# EAGLE design geiger_fixedR5R6 (EAGLE 7.4.0)
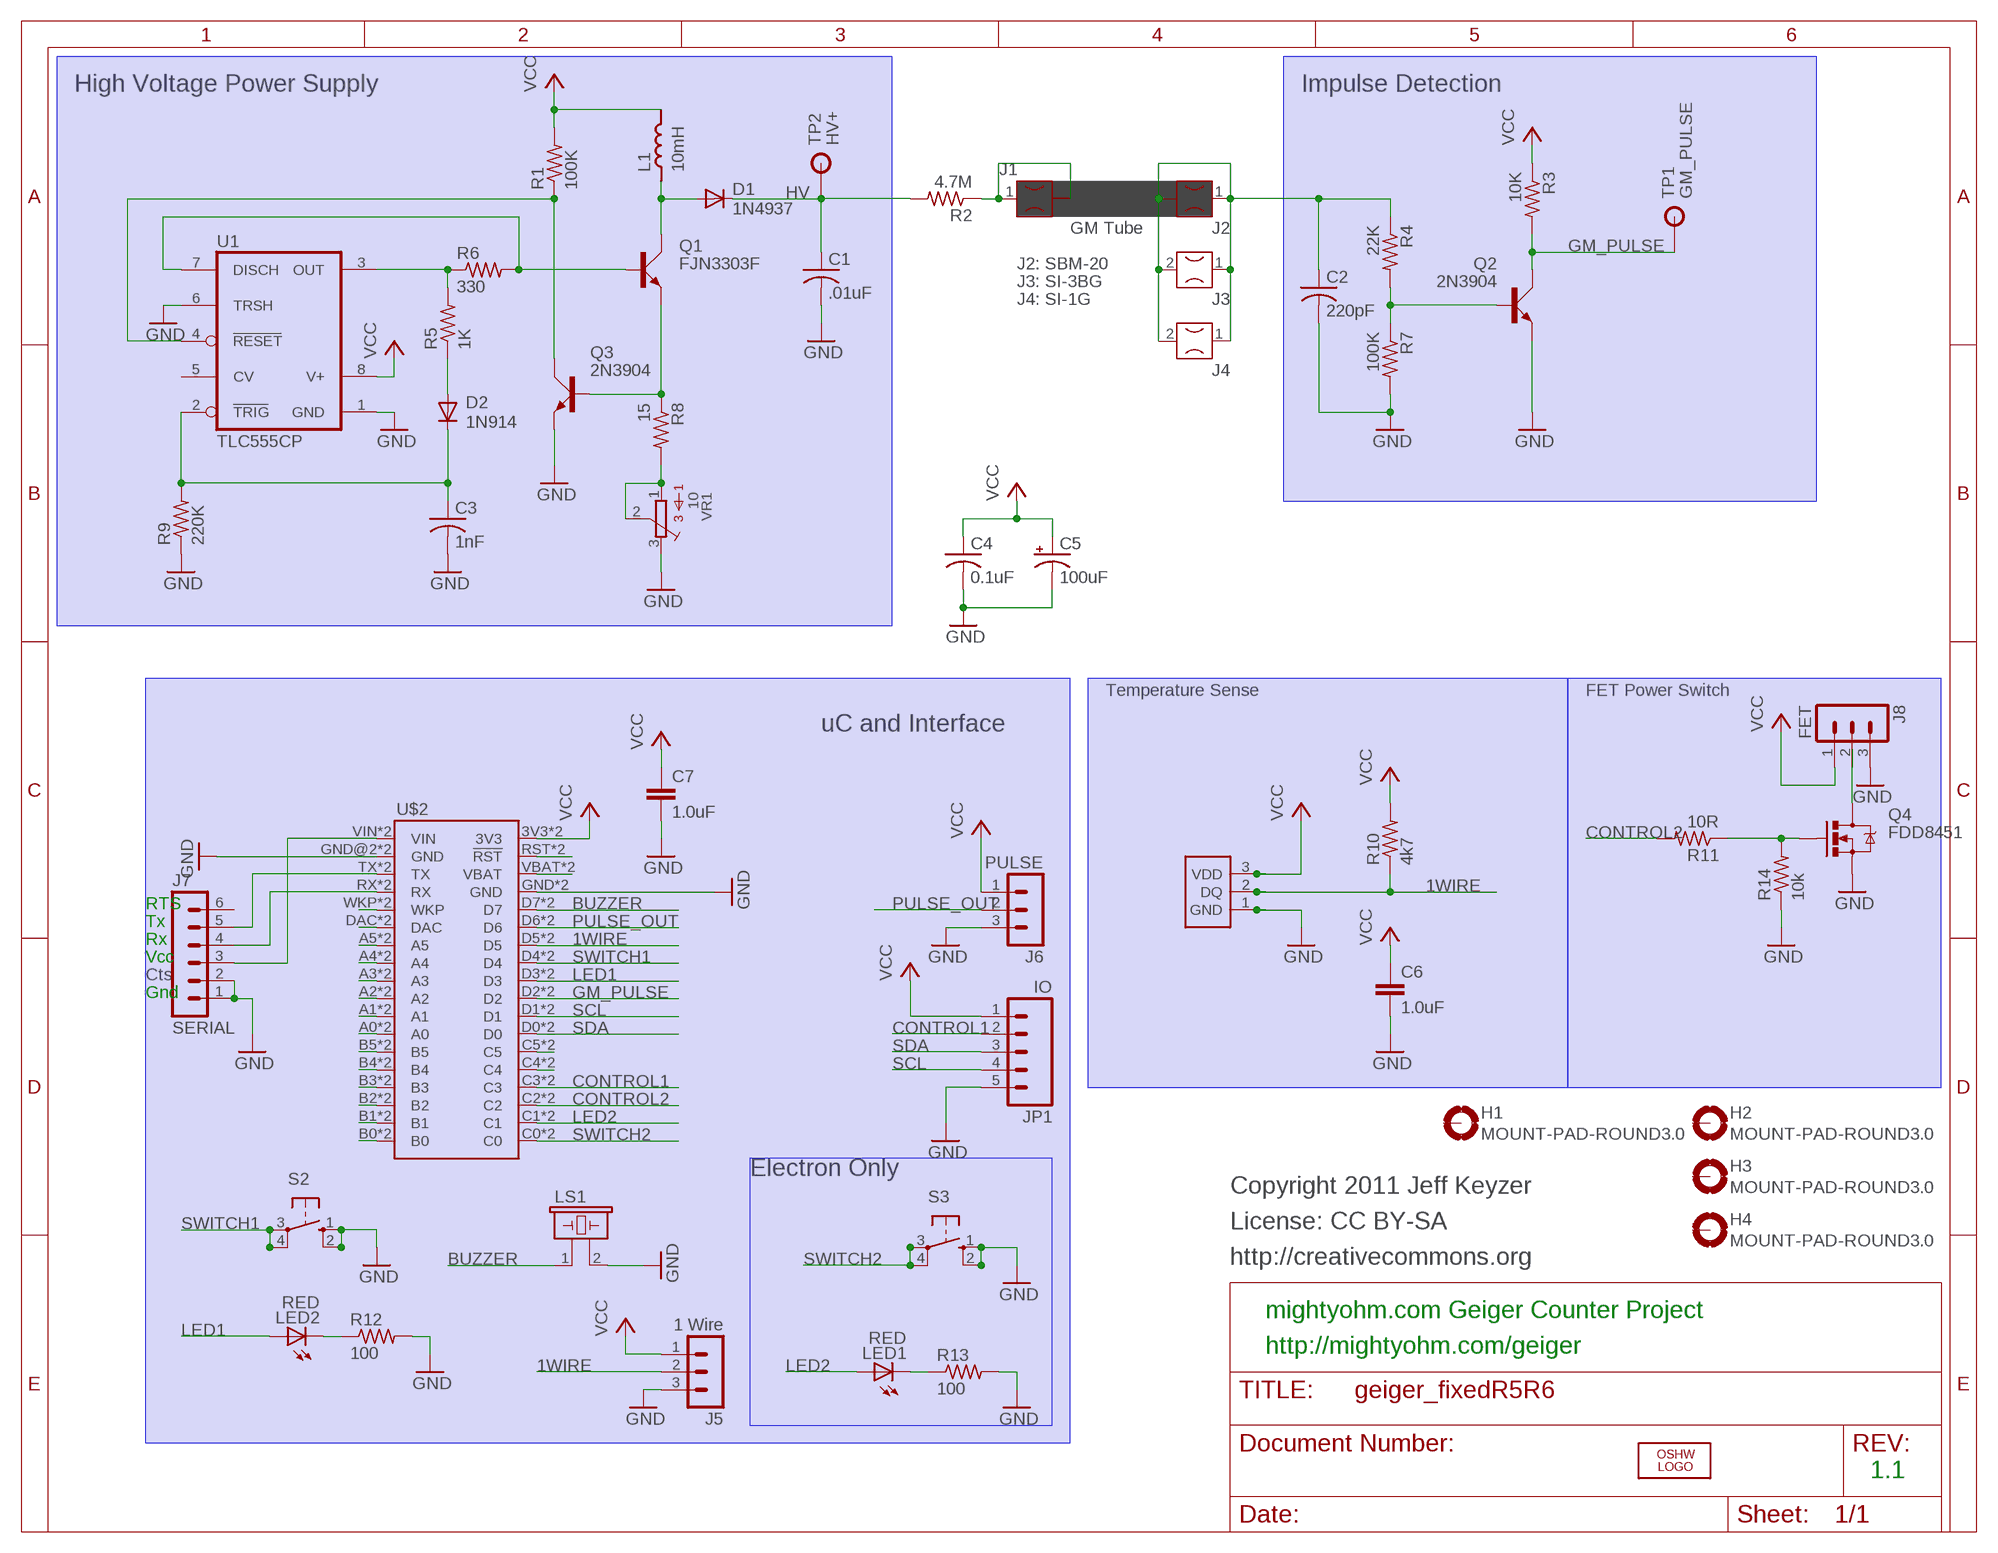
[diagram p0: schematic, sheet 1]

## Parts
C1  .01uF  C-US102-043X133  [C102-043X133]
C2  220pF  C-US050-030X075  [C050-030X075]
C3  1nF  C-US050-025X075  [C050-025X075]
C4  0.1uF  C-US025-025X050  [C025-025X050]
C5  100uF  CPOL-USE2.5-6  [E2,5-6]
C6  1.0uF  1.0UF-25V-+80/-20(0805)"  [0805-CAP]
C7  1.0uF  1.0UF-25V-+80/-20(0805)"  [0805-CAP]
D1  1N4937  1N4933  [DO41-10]
D2  1N914  1N4148DO35-7  [DO35-7]
H1  MOUNT-PAD-ROUND3.0  [3,0-PAD]
H2  MOUNT-PAD-ROUND3.0  [3,0-PAD]
H3  MOUNT-PAD-ROUND3.0  [3,0-PAD]
H4  MOUNT-PAD-ROUND3.0  [3,0-PAD]
J1  FUSECLIPPCMOUNT  [FUSECLIP_PCMOUNT]
J2  FUSECLIPPCMOUNT  [FUSECLIP_PCMOUNT]
J3  FUSECLIPPCMOUNT  [FUSECLIP_PCMOUNT]
J4  FUSECLIPPCMOUNT  [FUSECLIP_PCMOUNT]
J5  1 Wire  MA03-1  [MA03-1]
J6  PULSE  MA03-1  [MA03-1]
J7  SERIAL  MA06-1  [MA06-1]
J8  FET  MA03-1  [MA03-1]
JP1  IO  M05PTH  [1X05]
L1  10mH  INDELC09D  [ELC09D]
LED1  RED  LED5MM  [LED5MM]
LED2  RED  LED5MM  [LED5MM]
LOGO1  OSHW_LOGO_FILLX0200-NT  [OSHW_FILLX200_NOTEXT]
LS1  PIEZO17MM  [PS1740P02E]
Q1  FJN3303F  2N3704  [TO92C]
Q2  2N3904  [TO92D]
Q3  2N3904  [TO92D]
Q4  FDD8451  MOSFET-NCHANNELFDD8780  [DPAK]
R1  100K  R-US_0207/10  [0207/10]
R2  4.7M  R-US_0207/10  [0207/10]
R3  10K  R-US_0207/10  [0207/10]
R4  22K  R-US_0207/10  [0207/10]
R5  1K  R-US_0207/10  [0207/10]
R6  330  R-US_0207/10  [0207/10]
R7  100K  R-US_0207/10  [0207/10]
R8  15  R-US_0207/10  [0207/10]
R9  220K  R-US_0207/10  [0207/10]
R10  4k7  R-US_R0805  [R0805]
R11  10R  R-US_R0805  [R0805]
R12  100  R-US_R0805  [R0805]
R13  100  R-US_R0805  [R0805]
R14  10k  R-US_R0805  [R0805]
S1  DB18B20+  SENSOR-DS18B20  [TO-92-TRIANGLE]
S2  10-XX  [B3F-10XX]
S3  10-XX  [B3F-10XX]
TP1  GM_PULSE  TPPTH  [TP_PTH]
TP2  HV+  TPPTH  [TP_PTH]
U1  TLC555CP  ICM7555  [DIL08]
U$2  ELECTRONDUALNAMED  [ELECTRON_SIMPLE_SILK_NAMES_DUAL]
VR1  10  3386-P  [3386P]

## Nets
1WIRE: J5.2 R10.1 S1.2(DQ) U$2.D5 U$2.D5_1(D5)
BUZZER: LS1.1 U$2.D7 U$2.D7_1(D7)
CONTROL1: JP1.2 U$2.C3 U$2.C3_1(C3)
CONTROL2: R11.2 U$2.C2 U$2.C2_1(C2)
GM_PULSE: Q2.C R3.2 TP1.P$1(TP) U$2.D2 U$2.D2_1(D2)
GND: C1.2 C2.2 C3.2 C4.2 C5.- C6.2 C7.2 J5.3 J6.3 J7.1 J7.2 J8.3 JP1.5 LS1.2 Q2.E Q3.E Q4.3(S) R7.2 R9.1 R12.2 R13.2 R14.1 S1.1(GND) S2.1(S) S2.2(S1) S3.1(S) S3.2(S1) U1.1(GND) U1.6(TRSH) U$2.GND U$2.GND@2(GND) U$2.GND_1(GND) U$2.GND_1B(GND) VR1.3
HV: C1.1 D1.C R2.2 TP2.P$1(TP)
LED1: LED2.A U$2.D3 U$2.D3_1(D3)
LED2: LED1.A U$2.C1 U$2.C1_1(C1)
N$1: D2.A R5.1
N$2: U$2.RST(!RST) U$2.RST_1(!RST)
N$3: Q3.C R1.1 U1.4(RESET)
N$4: U$2.VBAT U$2.VBATT_1(VBAT)
N$5: U$2.C5 U$2.C5_1(C5)
N$6: J7.3 U$2.VIN U$2.VIN_1B(VIN)
N$7: J7.5 U$2.TX U$2.TX_1(TX)
N$8: Q1.B R6.2 U1.7(DISCH)
N$9: C3.1 D2.C R9.2 U1.2(TRIG)
N$10: R5.2 R6.1 U1.3(OUT)
N$11: Q1.E Q3.B R8.1
N$12: D1.A L1.1 Q1.C
N$13: J7.4 U$2.RX U$2.RX_1(RX)
N$14: Q2.B R4.2 R7.1
N$15: J1.1 J1.2 R2.1
N$16: U$2.WKP U$2.WKP_1(WKP)
N$17: U$2.DAC U$2.DAC_1(DAC)
N$18: LED2.K(C) R12.1
N$19: U$2.A5 U$2.A5_1(A5)
N$20: U$2.A4 U$2.A4_1(A4)
N$21: LED1.K(C) R13.1
N$22: U$2.A3 U$2.A3_1(A3)
N$23: R8.2 VR1.1 VR1.2
N$24: U$2.A2 U$2.A2_1(A2)
N$25: U$2.A1 U$2.A1_1(A1)
N$26: U$2.A0 U$2.A0_1(A0)
N$27: U$2.B5 U$2.B5_1(B5)
N$28: U$2.B4 U$2.B4_1(B4)
N$29: U$2.B3 U$2.B3_1(B3)
N$30: U$2.B2 U$2.B2_1(B2)
N$31: U$2.B1 U$2.B1_1(B1)
N$32: U$2.B0 U$2.B0_1(B0)
N$33: U$2.C4 U$2.C4_1(C4)
N$34: Q4.1(G) R11.1 R14.2
N$35: J8.2 Q4.4(D)
N$39: C2.1 J2.1 J2.2 J3.1 J3.2 J4.1 J4.2 R4.1
PULSE_OUT: J6.2 U$2.D6 U$2.D6_1(D6)
SCL: JP1.4 U$2.D1 U$2.D1_1(D1)
SDA: JP1.3 U$2.D0 U$2.D0_1(D0)
SWITCH1: S2.3(P) S2.4(P1) U$2.D4 U$2.D4_1(D4)
SWITCH2: S3.3(P) S3.4(P1) U$2.C0 U$2.C0_1(C0)
VCC: C4.1 C5.+ C6.1 C7.1 J5.1 J6.1 J8.1 JP1.1 L1.2 R1.2 R3.1 R10.2 S1.3(VDD) U1.8(V+) U$2.3V3 U$2.3V3_1(3V3)
Unconnected: H1.B3,0(MOUNT) H2.B3,0(MOUNT) H3.B3,0(MOUNT) H4.B3,0(MOUNT) J7.6 U1.5(CV)

## Notes on the sheet
- High Voltage Power Supply | Impulse Detection
- GM Tube
- J2: SBM-20
- J3: SI-3BG
- J4: SI-1G
- Temperature Sense | FET Power Switch
- uC and Interface
- RTS
- Tx
- Rx
- Vcc
- Cts
- Gnd
- Electron Only
- Copyright 2011 Jeff Keyzer
- License: CC BY-SA
- http://creativecommons.org
- mightyohm.com Geiger Counter Project
- http://mightyohm.com/geiger
- 1.1

## Library data of the parts
C1-C4 = resistor:C-US: CAPACITOR, American symbol
C5 = resistor:CPOL-US: POLARIZED CAPACITOR, American symbol
C6 C7 = SparkFun-Capacitors:1.0UF-25V-+80/-20(0805): CAP-11625; PROD_ID: CAP-11625
D1 = diode:1N4933: DIODE fast recovery rectifier, 1A
D2 = diode:1N4148: DIODE high speed (Philips)
H1-H4 = holes:MOUNT-PAD-ROUND: MOUNTING PAD, round
J1-J4 = connectors:FUSECLIP
J5 J6 J8 = mightyohm:MA03-1: PIN HEADER; OC_FARNELL: unknown; OC_NEWARK: unknown
J7 = connectors:MA06-1: PIN HEADER
JP1 = SparkFun-Connectors:M05: Header 5 Standard 5-pin 0.1" header. Use with straight break away headers (SKU : PRT-00116), right angle break away headers (PRT-00553), swiss pins (PRT-00743), machine pins (PRT-00117), and female headers (PRT-00115). Molex polarized connector foot print use with SKU : PRT-08230 with associated crimp pins and housings.
L1 = passives:IND: Inductor
LED1 LED2 = mightyohm:LED: MightyOhm Engineering Light Emitting Diodes (LEDs)
LOGO1 = OSHW:OSHW_LOGO_FILL
LS1 = mightyohm:PIEZO; OC_FARNELL: unknown; OC_NEWARK: unknown
Q1 = transistor-small-signal:2N3704: NPN TRANSISTOR
Q2 Q3 = transistor-small-signal:2N3904: NPN TRANSISTOR
Q4 = SparkFun-DiscreteSemi:MOSFET-NCHANNEL: Common NMOSFET Parts MFG P/N Store ID Prod ID FDD8780 TRANS-09984 SI7820DN TRANS-11055 FDS6630A IC-08089 2N7002PW TRANS-11151 FQP30N06L COM-10213 TRANS-10060 BSS123LT1G TRANS-08345 BSS138 TRANS-00830 BS170 2N7000; PROD_ID: TRANS-09984
R1-R9 R12 = resistor:R-US_: RESISTOR, American symbol
R10 R11 R13 R14 = resistor:R-US_: RESISTOR, American symbol; RESISTANCE: 100
S1 = SENSOR-DS18B20:SENSOR-DS18B20
S2 S3 = switch-omron:10-XX: OMRON SWITCH
TP1 TP2 = connectors:TP: Test Point JSK 1/14/11
U1 = maxim:ICM7555: TIMER
U$2 = Tinamous:ELECTRON
VR1 = BOURNS:3386-: 3386 Series 3/8" Square Trimmer

## Board
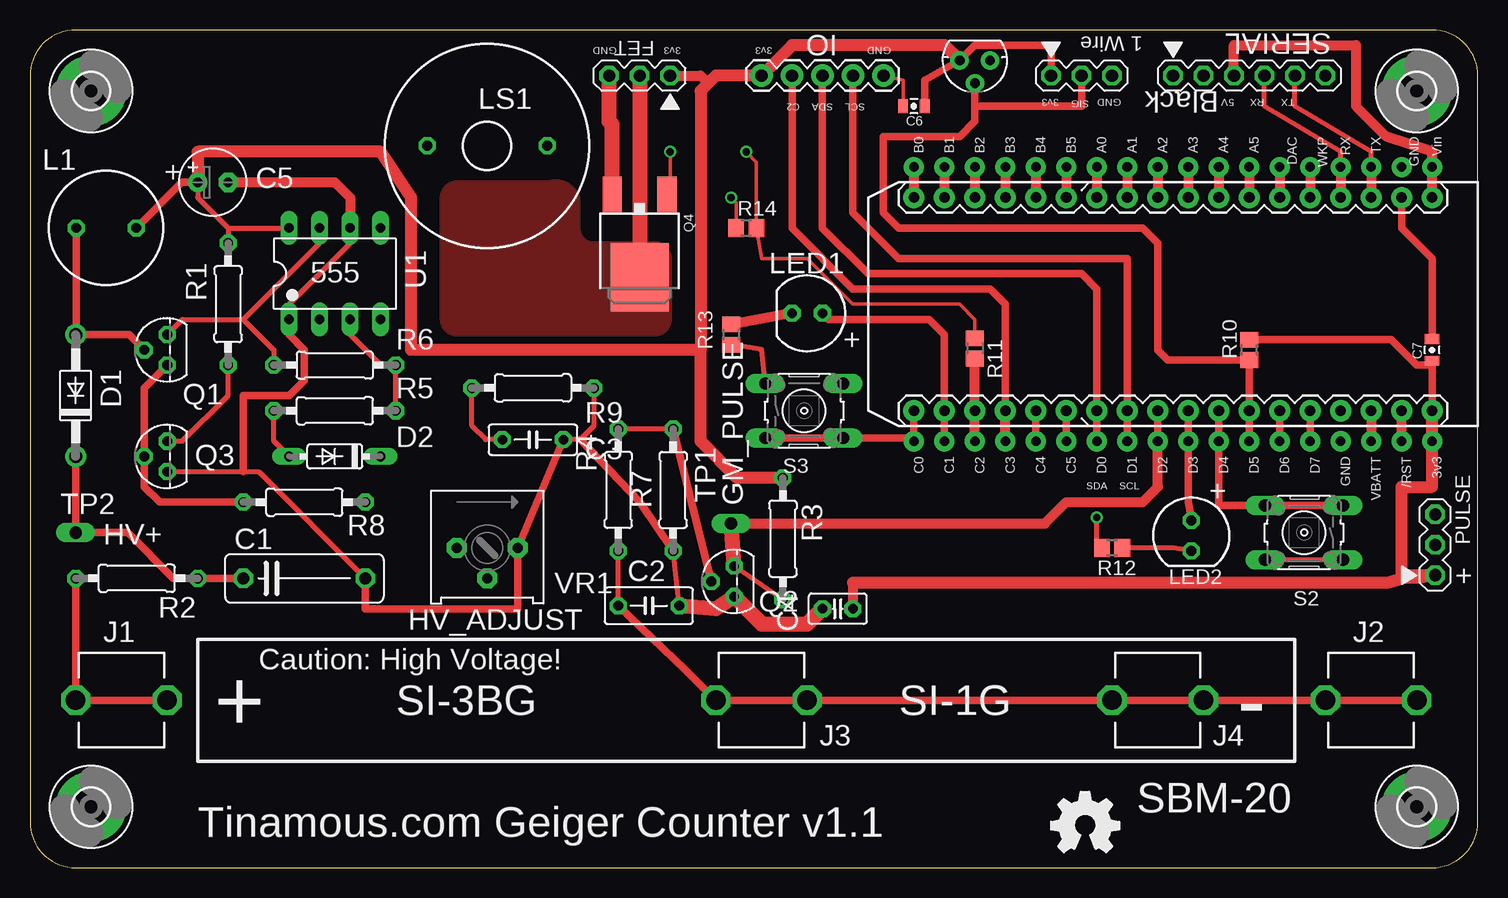
[diagram p1: board, top side]
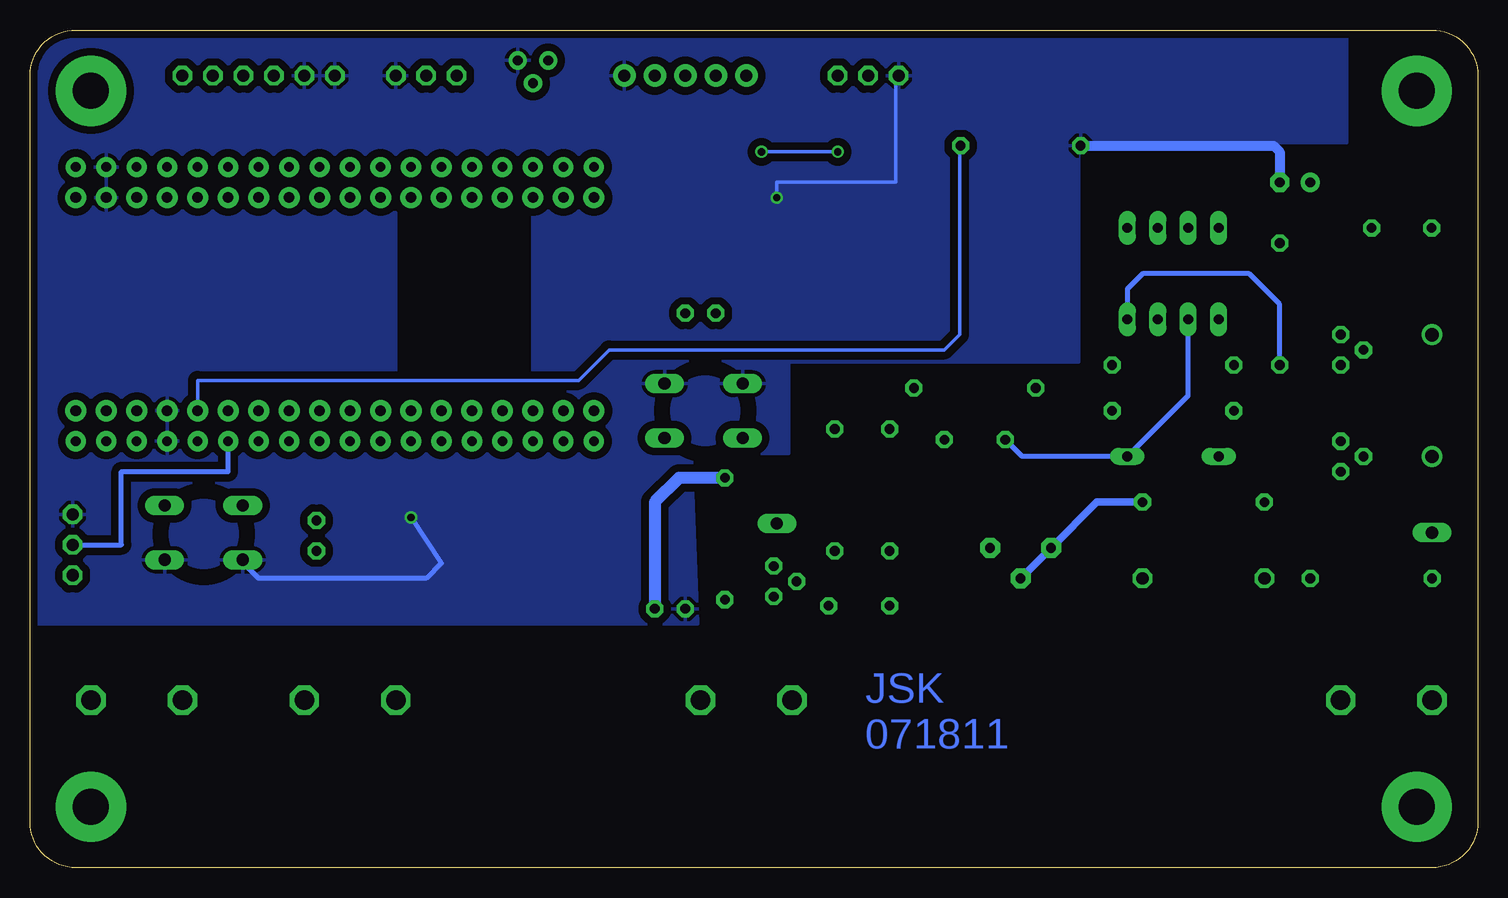
[diagram p2: board, bottom side, seen from below]

Size 120.65 x 69.85 mm. Coordinates in mm from the lower left corner, seen from the top.
Outline: 3.81,69.85 arc90 0,66.04 0,3.81 arc90 3.81,0 116.84,0 arc90 120.65,3.81 120.65,66.04 arc90 116.84,69.85 3.81,69.85
Copper layers (1*16): Top 0.035mm / dielectric 1.5mm / Bottom 0.0356mm
Design rules "generic_2l": minimum track width 8mil, minimum drill 20mil, track to track 8mil, track to pad 8mil, pad to pad 8mil, via to via 8mil, smd to smd 0mil, copper to edge 15mil, drill to drill 10mil, minimum pad ring 12mil, minimum via ring 8mil, stop-mask expansion 4mil, vias tented up to drill 25mil, thermal gap 12mil
bRestrict: area 102.6,24.2 to 109.8,31.4; area 60.8,34.5 to 68,41.7

### Footprints (pad centres in the part's own frame; a part is rotated, then mirrored left to right if it is on the bottom)
C102-043X133 = drill 1.016 octagon: 1 -5.08,0; 2 5.08,0
C050-030X075 = drill 0.813 octagon: 1 -2.54,0; 2 2.54,0
C050-025X075 = drill 0.813 octagon: 1 -2.54,0; 2 2.54,0
C025-025X050 = drill 0.813 octagon: 1 -1.27,0; 2 1.27,0
E2,5-6 = drill 0.813 pad 1.6: + -1.27,0 | drill 0.813 pad 1.6 octagon: - 1.27,0
0805-CAP = smd 0.8 x 1.2: 1 -0.9,0; 2 0.9,0
DO41-10 = drill 1.118: A 5.08,0; C -5.08,0
DO35-7 = drill 0.813 long: A 3.81,0; C -3.81,0
3,0-PAD = drill 3 pad 5.842: B3,0 0,0
FUSECLIP_PCMOUNT = drill 1.626 octagon: 1 0,0; 2 7.62,0
MA03-1 = drill 1.016 octagon: 1 -2.54,0; 2 0,0; 3 2.54,0
MA06-1 = drill 1.016 octagon: 1 -6.35,0; 2 -3.81,0; 3 -1.27,0; 4 1.27,0; 5 3.81,0; 6 6.35,0
1X05 = drill 1.016 pad 1.88: 1 0,0; 2 2.54,0; 3 5.08,0; 4 7.62,0; 5 10.16,0
ELC09D = drill 0.813 octagon: 1 -2.5,0; 2 2.5,0
LED5MM = drill 0.813 octagon: A -1.27,0; K 1.27,0
PS1740P02E = drill 0.813 octagon: 1 -5,0; 2 5,0
TO92C = drill 0.813 octagon: B 1.27,0; C 0,1.905; E -1.27,0
TO92D = drill 0.813 octagon: B 0,1.905; C 1.27,0; E -1.27,0
DPAK = smd 1.6 x 3: 1 -2.28,-5.31; 3 2.28,-5.31 | smd 4.826 x 5.715: 4 0,1.588
0207/10 = drill 0.813 octagon: 1 -5.08,0; 2 5.08,0
R0805 = smd 1.3 x 1.5: 1 -0.85,0; 2 0.85,0
TO-92-TRIANGLE = drill 0.813 pad 1.524: 1 -1.27,0; 2 0,1.905; 3 1.27,0
B3F-10XX = drill 1.016 long: 1 -3.251,2.261; 2 3.251,2.261; 3 -3.251,-2.261; 4 3.251,-2.261
TP_PTH = drill 1.016 long: P$1 0,0
DIL08 = drill 0.813 long: 1 -3.81,-3.81; 2 -1.27,-3.81; 3 1.27,-3.81; 4 3.81,-3.81; 5 3.81,3.81; 6 1.27,3.81; 7 -1.27,3.81; 8 -3.81,3.81
ELECTRON_SIMPLE_SILK_NAMES_DUAL = drill 0.889 pad 1.753: 3V3 1.27,22.86; A0 29.21,5.08; A1 26.67,5.08; A2 24.13,5.08; A3 21.59,5.08; A4 19.05,5.08; A5 16.51,5.08; B0 44.45,5.08; B1 41.91,5.08; B2 39.37,5.08; B3 36.83,5.08; B4 34.29,5.08; B5 31.75,5.08; C0 44.45,22.86; C1 41.91,22.86; C2 39.37,22.86; C3 36.83,22.86; C4 34.29,22.86; C5 31.75,22.86; D0 29.21,22.86; D1 26.67,22.86; D2 24.13,22.86; D3 21.59,22.86; D4 19.05,22.86; D5 16.51,22.86; D6 13.97,22.86; D7 11.43,22.86; DAC 13.97,5.08; GND 8.89,22.86; GND@2 3.81,5.08; RST 3.81,22.86; RX 8.89,5.08; TX 6.35,5.08; VBAT 6.35,22.86; VIN 1.27,5.08; WKP 11.43,5.08 | drill 0.8 pad 1.676: 3V3_1 1.27,25.4; A0_1 29.21,2.54; A1_1 26.67,2.54; A2_1 24.13,2.54; A3_1 21.59,2.54; A4_1 19.05,2.54; A5_1 16.51,2.54; B0_1 44.45,2.54; B1_1 41.91,2.54; B2_1 39.37,2.54; B3_1 36.83,2.54; B4_1 34.29,2.54; B5_1 31.75,2.54; C0_1 44.45,25.4; C1_1 41.91,25.4; C2_1 39.37,25.4; C3_1 36.83,25.4; C4_1 34.29,25.4; C5_1 31.75,25.4; D0_1 29.21,25.4; D1_1 26.67,25.4; D2_1 24.13,25.4; D3_1 21.59,25.4; D4_1 19.05,25.4; D5_1 16.51,25.4; D6_1 13.97,25.4; D7_1 11.43,25.4; DAC_1 13.97,2.54; GND_1 8.89,25.4; GND_1B 3.81,2.54; RST_1 3.81,25.4; RX_1 8.89,2.54; TX_1 6.35,2.54; VBATT_1 6.35,25.4; VIN_1B 1.27,2.54; WKP_1 11.43,2.54
3386P = drill 0.813 pad 1.676 octagon: 1 -2.54,0; 2 0,-2.54; 3 2.54,0

### Placement (x,y rotation side)
C1  22.86,24.13 0 top
C2  51.56,21.84 0 top
C3  41.91,35.69 0 top
C4  67.31,21.59 180 top
C5  15.24,57.15 0 top
C6  73.66,63.5 180 top
C7  116.84,43.18 90 top
D1  3.81,39.37 90 top
D2  25.4,34.29 180 top
H1  115.57,5.08 0 top
H2  115.57,64.77 0 top
H3  5.08,5.08 0 top
H4  5.08,64.77 0 top
J1  3.81,13.97 0 top
J2  107.95,13.97 0 top
J3  57.15,13.97 0 top
J4  90.17,13.97 0 top
J5  87.63,66.04 0 top
J6  117.09,26.92 90 top
J7  101.6,66.04 0 top
J8  50.8,66.04 180 top
JP1  60.96,66.04 0 top
L1  6.35,53.34 0 top
LED1  64.77,46.23 180 top
LED2  96.77,27.69 270 top
LOGO1  85.09,1.27 0 top
LS1  38.1,60.2 180 top
Q1  11.43,43.18 90 top
Q2  58.67,23.88 90 top
Q3  11.43,34.29 90 top
Q4  50.8,50.8 180 top
R1  16.51,46.99 90 top
R2  8.89,24.13 0 top
R3  62.74,27.43 270 top
R4  49.02,31.5 90 top
R5  25.4,38.1 0 top
R6  25.4,41.91 180 top
R7  53.59,31.5 270 top
R8  22.86,30.48 0 top
R9  41.91,40.01 180 top
R10  101.6,43.18 90 top
R11  78.74,43.31 270 top
R12  90.17,26.67 180 top
R13  58.42,44.45 270 top
R14  59.69,53.34 0 top
S1  78.74,67.31 180 top
S2  106.17,27.94 180 top
S3  64.52,38.1 0 top
TP1  58.42,28.7 0 top
TP2  3.81,27.94 0 top
U1  25.4,49.53 0 top
U$2  118.11,60.96 180 top
VR1  38.1,26.67 0 top

### Tracks (layer width: path | path; a pad name or v marks a point on that pad's centre or on a via)
1WIRE
  Top 0.61: U$2.D5 U$2.D5_1 R10.1 94.83,42.33 93.98,43.18 93.98,52.07 92.71,53.34 72.39,53.34 71.12,54.61 71.12,60.96 77.47,60.96 78.74,62.23 78.74,63.5 | 78.74,63.5 S1.2 | J5.2 87.63,63.5 78.74,63.5
BUZZER
  Top 0.61: U$2.D7_1 U$2.D7
  Bottom 0.305: U$2.D7 106.68,40.64 74.93,40.64 72.39,43.18 44.45,43.18 43.18,44.45 43.18,59.69 | 43.18,59.69 43.18,60.12 | 43.18,60.12 LS1.1 43.1,59.77 43.18,59.69 | 43.18,60.28 43.18,60.12
CONTROL1
  Top 0.61: U$2.C3 81.28,46.99 80.01,48.26 68.58,48.26 63.5,53.34 JP1.2
  Top 0.813: U$2.C3_1 U$2.C3
CONTROL2
  Top 0.813: U$2.C2_1 U$2.C2 R11.2
GM_PULSE
  Top 0.406: Q2.C R3.2
  Top 0.61: U$2.D2_1 U$2.D2
  Top 0.813: TP1.P$1 84.58,28.7 86.36,30.48 92.71,30.48 93.98,31.75 U$2.D2_1
  Top 1.27: Q2.C TP1.P$1
GND  (via drill 0.6)
  Top 0.305: C6.2 72.76,65.67 JP1.5 | R14.1 58.84,55.46 v58.42,55.88
  Top 0.406: C2.2 R7.2 | U1.1 21.59,46.99 26.67,52.07 U1.6 | Q3.E 17.78,33.02 19.05,33.02 C1.2 | C3.2 45.85,35.69 46.99,36.83 R9.1 | S2.1 S2.2 102.73,25.68 | S3.1 60.96,43.2 R13.2 | R12.2 88.9,27.09 v88.9,29.21
  Top 0.61: C1.2 27.94,21.59 40.64,21.59 VR1.3 C3.2 | 45.85,35.69 50.8,30.48 R7.2 | U1.1 21.59,44.45 22.86,43.18 22.86,40.64 21.59,39.37 17.78,39.37 17.78,33.02 | C7.2 116.84,50.8 114.3,53.34 U$2.GND@2
  Top 0.813: C5.- 25.4,57.15 26.67,55.88 U1.6
  Top 1.27: C2.2 57.15,21.59 Q2.E 60.96,20.32 64.77,20.32 C4.2 | Q4.3 48.52,61.97 48.26,62.23 J8.3
  Bottom 0.305: v58.42,55.88 58.42,57.15 48.52,57.15 48.52,65.78 J8.3
  Bottom 0.406: v88.9,29.21 86.36,25.4 87.63,24.13 101.6,24.13 102.92,25.45 S2.2
  Bottom 0.813: LS1.2 17.02,60.2 16.51,59.69 C5.-
  pour Bottom (isolate 0.635): 78.74,69.85 10.92,69.85 10.92,60.45 33.27,60.45 33.27,42.16 57.4,42.16 57.4,34.54 65.53,34.54 65.02,20.32 78.74,20.32
  pour Bottom (isolate 0.635): 87.63,54.61 78.74,54.61 78.74,69.85 120.65,69.85 120.65,20.32 78.74,20.32 78.74,39.37 87.63,39.37 87.63,36.83 92.71,36.83 92.71,39.37 90.17,39.37 90.17,54.61 92.71,54.61 92.71,57.15 87.63,57.15
HV
  Top 0.61: D1.C TP2.P$1 8.13,27.94 11.94,24.13 R2.2 C1.1
LED1
  Top 0.61: U$2.D3 U$2.D3_1 96.52,30.48 96.77,29.21 LED2.A
LED2
  Top 0.61: LED1.A 66.55,45.72 74.93,45.72 76.2,44.45 U$2.C1 U$2.C1_1
N$1
  Top 0.406: D2.A 20.32,35.56 R5.1
N$2
  Top 0.813: U$2.RST_1 U$2.RST
N$3
  Top 0.406: R1.1 16.51,39.37 12.7,35.56 Q3.C
  Bottom 0.406: U1.4 29.21,48.26 27.94,49.53 19.05,49.53 16.51,46.99 R1.1
N$4
  Top 0.813: U$2.VBAT U$2.VBATT_1
N$5
  Top 0.61: U$2.C5 U$2.C5_1
N$6
  Top 0.813: U$2.VIN U$2.VIN_1B 116.84,59.69 113.03,60.96 110.49,63.5 110.49,68.58 100.33,68.58 J7.3
N$7
  Top 0.406: U$2.TX_1 111.76,59.69 105.41,63.5 J7.5
  Top 0.813: U$2.TX_1 U$2.TX
N$8
  Top 0.406: U1.7 24.13,52.07 17.78,45.72 | 17.78,45.72 20.32,43.18 R6.2 | Q1.B 12.7,45.72 17.78,45.72
N$9
  Top 0.406: C3.1 37.97,35.69 36.83,36.83 R9.2
  Bottom 0.406: U1.2 24.13,39.37 D2.C 37.97,34.29 C3.1
N$10
  Top 0.406: R5.2 R6.1 29.21,41.91 26.67,44.45 U1.3
N$11
  Top 0.61: Q1.E 9.53,40.01 Q3.B 9.53,31.75 10.79,30.48 R8.1
N$12
  Top 0.406: D1.A 3.85,44.49
  Top 0.61: 3.85,44.49 L1.1 | D1.A 8.26,44.45 Q1.C
N$13
  Top 0.406: U$2.RX_1 109.22,59.69 102.87,63.5 J7.4
  Top 0.813: U$2.RX_1 U$2.RX
N$14
  Top 0.406: R7.1 R4.2
  Top 0.61: R7.1 Q2.B
N$15
  Top 0.61: J1.2 J1.1 R2.1
N$16
  Top 0.813: U$2.WKP_1 U$2.WKP
N$17
  Top 0.813: U$2.DAC_1 U$2.DAC
N$18
  Top 0.406: LED2.K 95.25,26.67 R12.1
N$19
  Top 0.813: U$2.A5_1 U$2.A5
N$20
  Top 0.813: U$2.A4_1 U$2.A4
N$21
  Top 0.813: LED1.K R13.1
N$22
  Top 0.813: U$2.A3_1 U$2.A3
N$23
  Bottom 0.61: R8.2 31.75,30.48 VR1.1 VR1.2
N$24
  Top 0.813: U$2.A2_1 U$2.A2
N$25
  Top 0.813: U$2.A1_1 U$2.A1
N$26
  Top 0.813: U$2.A0_1 U$2.A0
N$27
  Top 0.813: U$2.B5_1 U$2.B5
N$28
  Top 0.813: U$2.B4_1 U$2.B4
N$29
  Top 0.813: U$2.B3_1 U$2.B3
N$30
  Top 0.813: U$2.B2_1 U$2.B2
N$31
  Top 0.813: U$2.B1_1 U$2.B1
N$32
  Top 0.813: U$2.B0_1 U$2.B0
N$33
  Top 0.61: U$2.C4 U$2.C4_1
N$34  (via drill 0.6)
  Top 0.305: R11.1 78.74,45.72 77.47,46.99 68.58,46.99 64.77,50.8 60.96,50.8 R14.2 60.54,58.84 v59.69,59.69 | v53.34,59.69 53.34,56.37 Q4.1
  Bottom 0.305: v59.69,59.69 v53.34,59.69
N$35
  Top 1.27: J8.2 Q4.4
  pour Top (no thermals): 52.07,52.07 46.99,52.07 arc-90 45.72,53.34 45.72,55.88 arc90 43.18,57.15 35.56,57.15 arc90 34.29,55.88 34.29,45.72 arc90 35.56,44.45 52.07,44.45 arc90 53.34,45.72 53.34,50.8 arc90
N$39
  Top 0.406: C2.1 R4.1
  Top 0.61: J2.2 J2.1 J4.2 J4.1 J3.2 J3.1 54.61,16.51 C2.1
PULSE_OUT
  Top 0.61: U$2.D6_1 U$2.D6
  Bottom 0.406: J6.2 113.03,26.92 113.03,33.02 104.14,33.02 U$2.D6_1
SCL
  Top 0.61: U$2.D1_1 U$2.D1 91.44,50.8 72.39,50.8 68.58,54.61 JP1.4
SDA
  Top 0.61: U$2.D0_1 U$2.D0 88.9,48.26 87.63,49.53 69.85,49.53 66.04,53.34 JP1.3
SWITCH1
  Top 0.61: S2.3 S2.4 99.06,30.2 U$2.D4_1 U$2.D4
SWITCH2
  Top 0.305: 73.38,35.84 U$2.C0_1
  Top 0.61: S3.3 S3.4 73.38,35.84 | U$2.C0 U$2.C0_1
VCC
  Top 0.406: 16.51,53.34 R1.2 | 16.51,53.34 13.97,55.88 C5.+ | 16.51,53.34 U1.8
  Top 0.61: L1.2 12.66,57.15 C5.+ | U$2.3V3 C7.1 116.47,41.91 115.57,41.91 113.45,44.03 R10.2 | J5.1 85.09,68.58 78.74,68.58 S1.3 74.56,65.67 C6.1
  Top 0.813: 68.58,23.75 C4.1 | J6.1 115.82,24.13 114.3,24.13 114.3,24.38 | J8.1 55.88,66.04 56.52,65.41
  Top 1.016: 68.58,23.75 113.03,23.75 114.3,24.13 | U$2.3V3 U$2.3V3_1 116.84,31.75 114.3,31.75 114.3,24.38 J6.1 | 55.88,43.18 31.75,43.18 31.75,55.88 29.21,59.69 13.97,59.69 C5.+ | R3.1 58.93,32.51 55.88,35.56 55.88,43.18 | 55.88,43.18 55.88,64.77 56.52,65.41 57.15,66.04 JP1.1 63.5,68.58 76.2,68.58 S1.3
  Bottom 1.016: R3.1 66.55,32.51 68.58,30.48 C4.1

### Text on the board
Bottom: JSK | 071811
tPlace: GND | 3v3 | 3v3 | GND | Black | C2 | SDA | SCL | 3v3 | SIG | GND | 5V | RX | TX | + | 555 | SDA | SCL | + | HV_ADJUST | Caution: High Voltage! | SI-3BG | SI-1G | + | - | SBM-20 | Tinamous.com Geiger Counter v1.1